# EAGLE design Adafruit OLED 128x32 Mono (EAGLE 9.6.2)
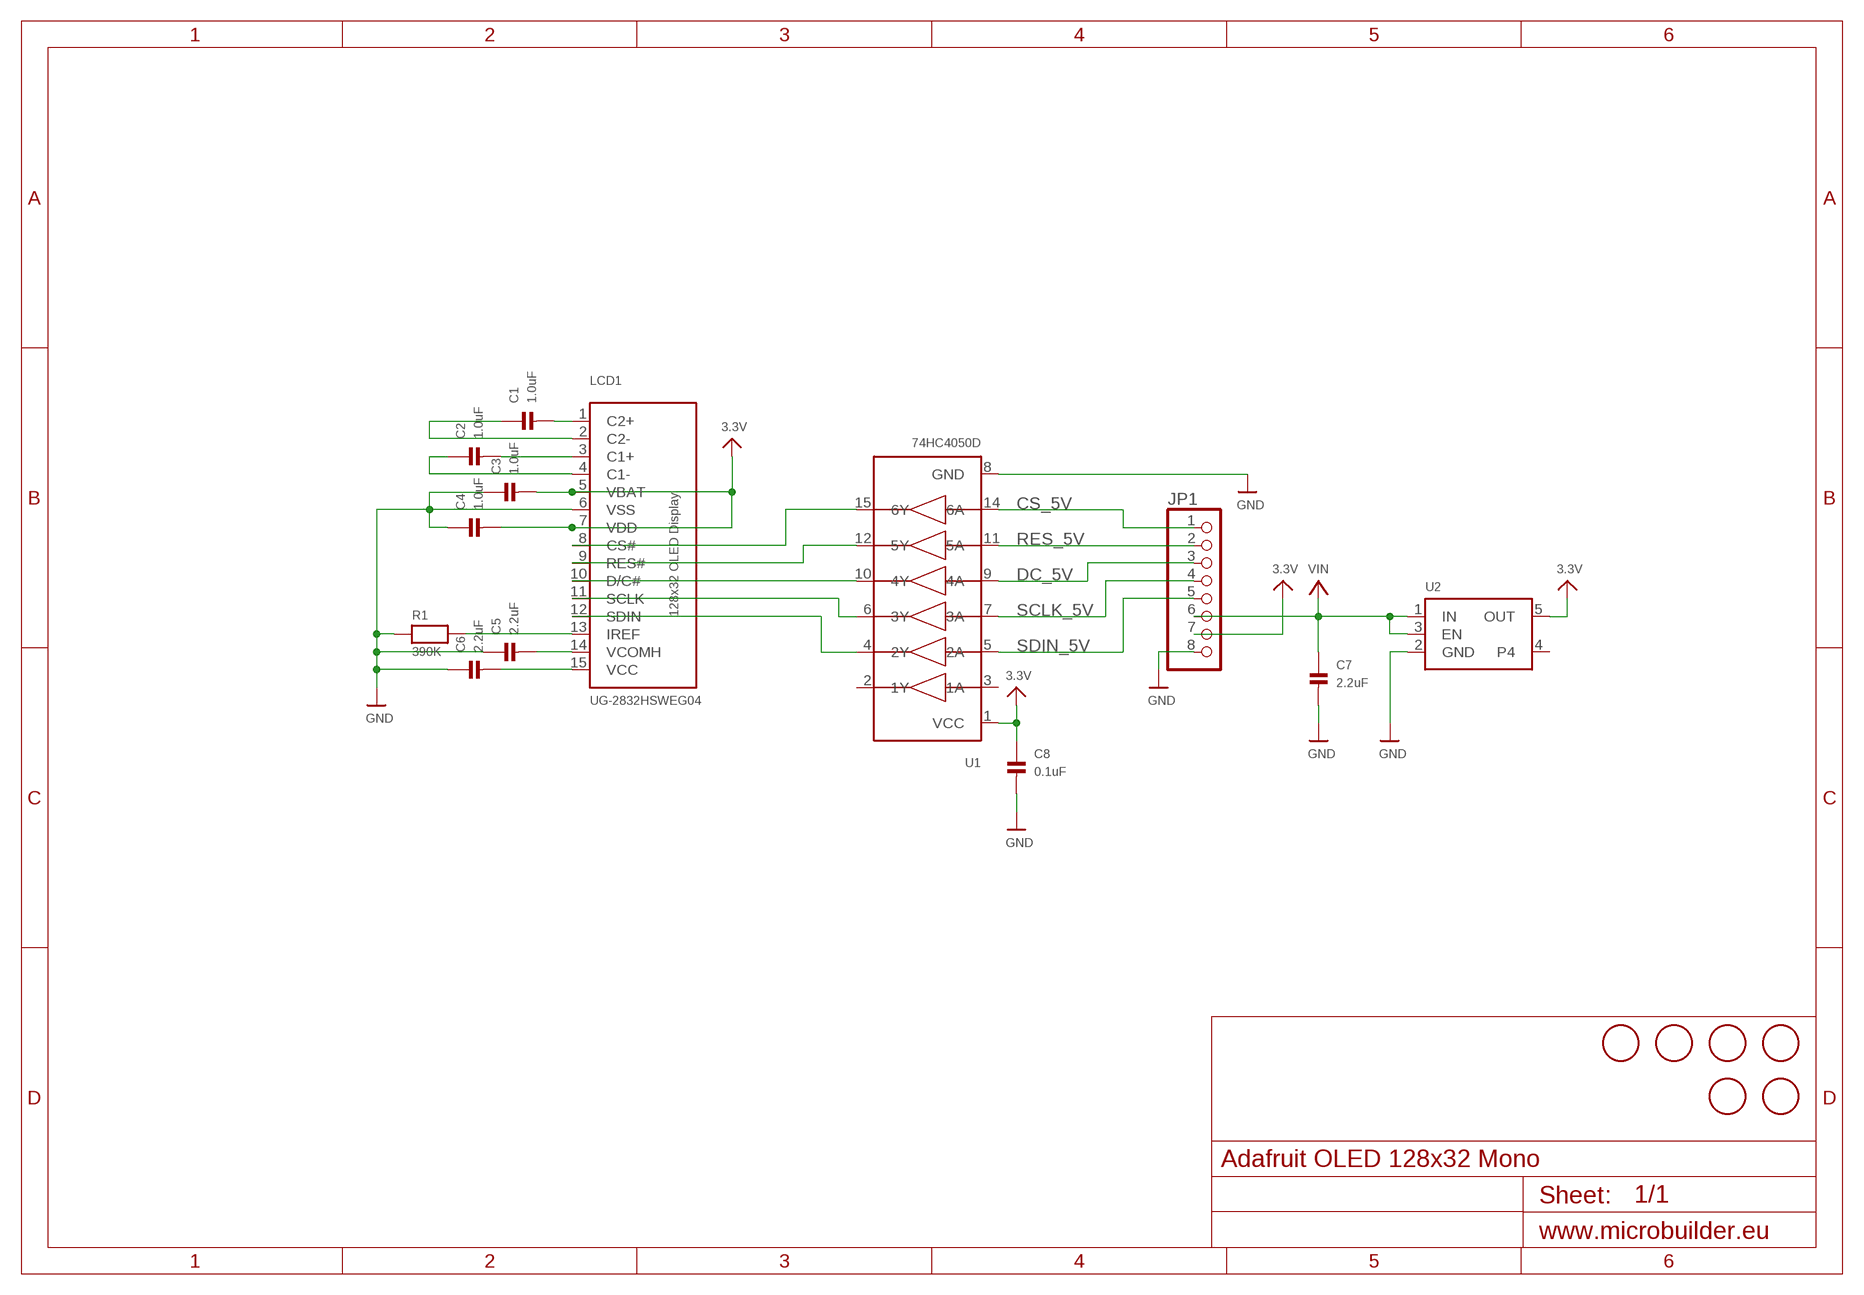
[diagram p0: schematic, sheet 1]

## Parts
C1  1.0uF  CAP_CERAMIC0805  [0805]
C2  1.0uF  CAP_CERAMIC0805  [0805]
C3  1.0uF  CAP_CERAMIC0805  [0805]
C4  1.0uF  CAP_CERAMIC0805  [0805]
C5  2.2uF  CAP_CERAMIC0805  [0805]
C6  2.2uF  CAP_CERAMIC0805  [0805]
C7  2.2uF  CAP_CERAMIC0805  [0805]
C8  0.1uF  CAP_CERAMIC0805  [0805]
JP1  HEADER-1X876MIL  [1X08_ROUND_76]
LCD1  UG-2832HSWEG04  OLED_UG-2832HSWEG04WRAPAROUND  [UG-2832HSWEG04_WRAPAROUND]
R1  390K  RESISTOR0805  [0805]
U1  74HC4050D  [SOIC16]
U2  VREG_SOT23-5  [SOT23-5]
U$2  MOUNTINGHOLE2.0  [MOUNTINGHOLE_2.0_PLATED]
U$3  MOUNTINGHOLE2.0  [MOUNTINGHOLE_2.0_PLATED]
U$4  MOUNTINGHOLE2.0  [MOUNTINGHOLE_2.0_PLATED]
U$5  MOUNTINGHOLE2.0  [MOUNTINGHOLE_2.0_PLATED]
U$6  FIDUCIAL  [FIDUCIAL_1MM]
U$7  FIDUCIAL  [FIDUCIAL_1MM]

## Nets
3.3V: C3.2 C4.2 C8.1 JP1.7 LCD1.5(VBAT) LCD1.7(VDD) U1.1(VCC) U2.5(OUT)
CS_5V: JP1.1 U1.14(6A)
DC_5V: JP1.3 U1.9(4A)
GND: C3.1 C4.1 C5.1 C6.1 C7.2 C8.2 JP1.8 LCD1.6(VSS) R1.1 U1.8(GND) U2.2(GND)
N$1: C1.1 LCD1.2(C2-)
N$2: C1.2 LCD1.1(C2+)
N$3: C2.1 LCD1.4(C1-)
N$4: C2.2 LCD1.3(C1+)
N$5: LCD1.8(CS#) U1.15(6Y)
N$8: LCD1.13(IREF) R1.2
N$9: C5.2 LCD1.14(VCOMH)
N$11: LCD1.9(RES#) U1.12(5Y)
N$12: LCD1.10(D/C#) U1.10(4Y)
N$13: LCD1.11(SCLK) U1.6(3Y)
N$14: LCD1.12(SDIN) U1.4(2Y)
N$15: C6.2 LCD1.15(VCC)
RES_5V: JP1.2 U1.11(5A)
SCLK_5V: JP1.4 U1.7(3A)
SDIN_5V: JP1.5 U1.5(2A)
VIN: C7.1 JP1.6 U2.1(IN) U2.3(EN)
Unconnected: U1.2(1Y) U1.3(1A) U2.4

## Library data of the parts
C1-C8 = microbuilder:CAP_CERAMIC: Ceramic Capacitors 0402 - 0402 Surface Mount Capacitors 16pF 50V 5% [Digikey: 445-4899-2-ND] 18pF 50V 5% [Digikey: 490-1281-2-ND] 22pF 50V 5% [Digikey: 490-1283-2-ND] 68pF 50V 5% [Digikey: 490-1289-2-ND] 0.1uF 10V 10% [Digikey: 490-1318-2-ND] 1.0uF 6.3V 10% [Digikey: 490-1320-2-ND] 0603 - 0603 Surface Mount Capacitors 16 pF 50V 5% [Digikey: 445-5051-2-ND] 22 pF 50V [Digikey: PCC220ACVTR-ND] 33 pF 50V 5% [Digikey: 490-1415-1-ND] 56pF 50V 5% [Digikey: 490-1421-1-ND] 220pF 50V 5% [Digikey: 445-1285-1-ND] 680 pF 50V 2200 pF 50V 5% C0G [Digikey: 445-1297-1-ND] 5600 pF 100V 5% X7R [Digikey: 478-3711-1-ND] 0.1 µF 25V 10% [Digikey: PCC2277TR-ND] 0.22 µF 16V 10% X7R [Digikey: 445-1318-1-ND] 1.0 µF 25V 10% [Digikey: 445-5146-2-ND] 0603 - RF Specific 3pF 250V +/-0.1pF RF [Digikey: 712-1347-1-ND] 18 pF 250V 5% [Digikey: 478-3505-1-ND or 712-1322-1-ND] 56 pF 250V 5% C0G RF [Digikey: 490-4867-1-ND] 68 pF 250V RF [Digikey: 490-4868-1-ND] 0805 - 0805 Surface Mount Capacitors 220 pF 250V 2% RF Ceramic Capacitor [Digikey: 712-1398-1-ND] 1000 pF 50V 2% NP0 Ceramic Capacitor [Digikey: 478-3760-1-ND] 0.1 µF 25V 10% Ceramic Capacitor [Digikey: PCC1828TR-ND] 1.0 µF 16V 10% Ceramic Capacitor[Digikey: 490-1691-2-ND] 10.0 µF 10V 10% Ceramic Capacitor[Digikey: 709-1228-1-ND] 10.0 uF 16V 10% Ceramic Capacitor [Digikey: 478-5165-2-ND] 47 uF 6.3V 20% Ceramic Capacitor [Digikey: 399-5506-1-ND] 1206 - 1206 Surface Mount Capacitors 47uF 10V 20% Ceramic Capacitor [Digikey: 399-5508-1-ND]
JP1 = microbuilder:HEADER-1X8: PIN HEADER
LCD1 = microbuilder:OLED_UG-2832HSWEG04: 128x32 SPI 0.91" Monochrome OLED Display
R1 = microbuilder:RESISTOR: Resistors 0402 - 0402 Surface Mount Package 22 Ohm 1% 1/16W [Digikey: 311-22.0LRTR-ND] 33 Ohm 5% 1/16W 1.0K 5% 1/16W 1.5K 5% 1/16W 2.0K 1% 1/16W 10.0K 1% 1/16W [Digikey: 311-10.0KLRTR-ND] 10.0K 5% 1/16W [Digikey: RMCF0402JT10K0TR-ND] 12.1K 1% 1/16W [Digikey: 311-22.0LRTR-ND] 100.0K 5% 1/16W 0603 - 0603 Surface Mount Package 0 Ohm 1/10 Watt 1% Resistor 15 Ohm 1/10 Watt 1% Resistor 33 Ohm 1/10 Watt 1% Resistor 49.9 Ohm 1/10 Watt 1% Resistor 100 Ohm 1/10 Watt 1% Resistor 150 Ohm 1/10 Watt 1% Resistor 240 Ohm 1/10 Watt 1% Resistor 390 Ohm 1/10 Watt 1% Resistor 560 Ohm 1/10 Watt 1% Resistor 680 Ohm 1/10 Watt 1% Resistor 750 Ohm 1/10 Watt 1% Resistor 1.0K Ohm 1/10 Watt 1% Resistor 1.5K Ohm 1/10 Watt 1% Resistor 2.0K Ohm 1/10 Watt 1% Resistor 2.2K Ohm 1/10 Watt 1% Resistor 3.3K Ohm 1/10 Watt 1% Resistor 4.7K Ohm 1/10 Watt 1% Resistor 10.0K Ohm 1/10 Watt 1% Resistor 12.0K Ohm 1/10 Watt 1% Resistor 12.1K Ohm 1/10 Watt 1% Resistor 20.0K Ohm 1/10 Watt 1% Resistor 33.0K Ohm 1/10 Watt 1% Resistor 100.0K Ohm 1/10 Watt 1% Resistor 0805 - 0805 Surface Mount Package 0 Ohm 1/8 Watt 1% Resistor 33 Ohm 1/8 Watt 1% Resistor 100 Ohm 1/8 Watt 1% Resistor 150 Ohm 1/8 Watt 1% Resistor 200 Ohm 1/8 Watt 1% Resistor 240 Ohm 1/8 Watt 1% Resistor 330 Ohm 1/8 Watt 1% Resistor 390 Ohm 1/8 Watt 1% Resistor 470 Ohm 1/8 Watt 1% Resistor 1.0K Ohm 1/8 Watt 1% Resistor 1.5K Ohm 1/8 Watt 1% Resistor 2.0K Ohm 1/8 Watt 1% Resistor 4.7K Ohm 1/8 Watt 1% Resistor 5.1K Ohm 1/8 Watt 1% Resistor 5.6K Ohm 1/8 Watt 1% Resistor 10.0K Ohm 1/8 Watt 1% Resistor 22.0K Ohm 1/8 Watt 1% Resistor 33.0K Ohm 1/8 Watt 1% Resistor 100K Ohm 1/8 Watt 1% Resistor 1206 - 1206 Surface Mount Package
U1 = microbuilder:74HC4050D: 6-channel level shifter 74HC4050D - 2V-6V Supply Digikey: 74HC4050D,653-ND Mouser: 771-74HC4050D-T
U2 = microbuilder:VREG_SOT23-5: SOT23-5 Fixed Voltage Regulators To better organise some of the SOT23-5 fixed voltage regulators in this library, this new part was created. Part Current Out V Out V In V Dropout Digikey Part No. ADP121 150mA 3.3V 3.4-5.5V 0.09V @ 150mA ADP121-AUJZ33R7CT-ND ADP121 150mA 3.0V 3.1-5.5V 0.09V @ 150mA ADP121-AUJZ30R7CT-ND ADP122 300mA 3.3V 3.4-5.5V 0.085V @ 300mA ADP122AUJZ-3.3-R7CT-ND ADP1712 300mA 3.3V 3.5-5.5V 0.17V @ 300mA ADP1712AUJZ-3.3-R7TR-ND AP7311 (Low Cost) 150mA 3.3V 3.5-6V 0.15V @ 150mA AP7311-33WG-7DICT-ND LD39015M18R 150mA 1.8V 1.9V-5.5V 0.08V @ 100mA 497-6977-1-ND MCP1824T-3302E/OT 300mA 3.3V 3.5V-6V 0.2V @ 300mA MCP1824T-3302E/OTCT-ND MIC5205-2.5YM5 TR 150mA 2.5V 2.7-16V 0.165V @ 150mA 576-1257-2-ND MIC5205-3.0YM5 TR 150mA 3.0V 3.2V-16V 0.165V @ 150mA 576-1258-2-ND MIC5205-3.3YM5 TR 150mA 3.3V 3.5V-16V 0.165V @ 150mA 576-1259-2-ND TPS780330220 150mA 3.3V+2.2V 3.6-5.5V 250mV Max 296-23332-1-ND TDA3663/N1,135 100mA 3.3V 3.5-45V 0.18V @ 50mA 568-5343-1-ND
U$2-U$5 = microbuilder:MOUNTINGHOLE: Mounting Hole
U$6 U$7 = adafruit:FIDUCIAL: For use by pick and place machines to calibrate the vision/machine, 1mm By microbuilder.eu

## Board
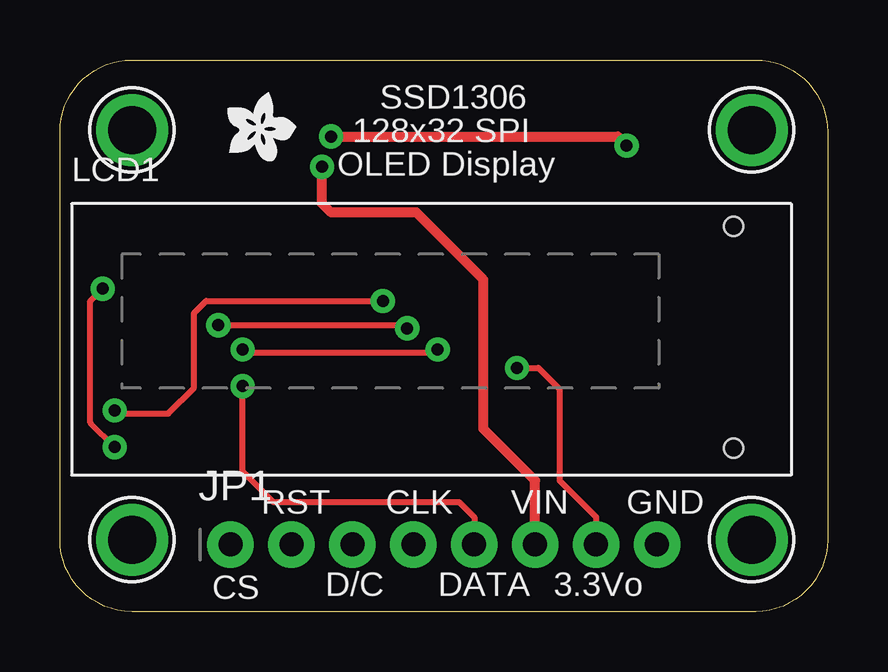
[diagram p1: board, top side]
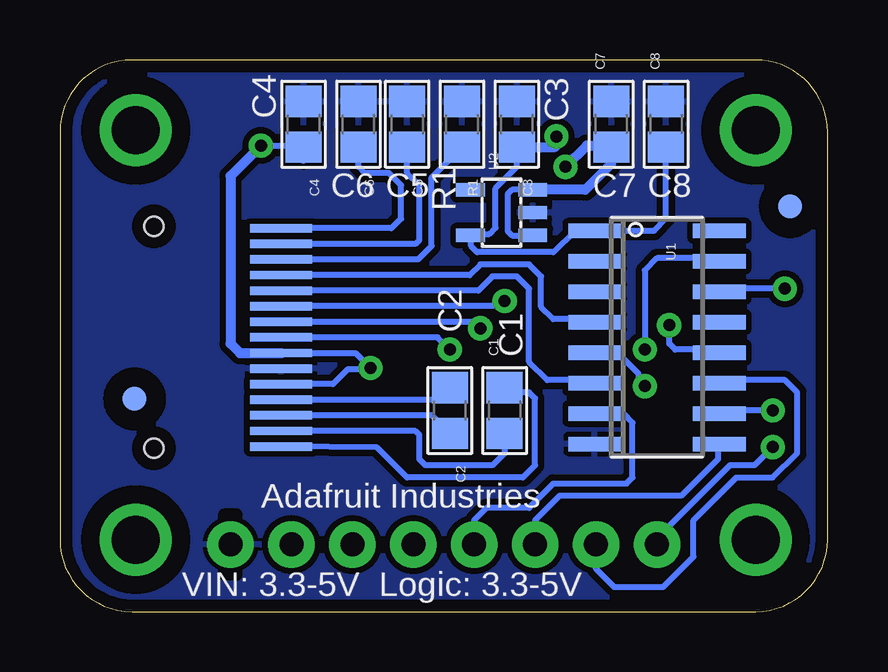
[diagram p2: board, bottom side, seen from below]

Size 32 x 23 mm. Coordinates in mm from the lower left corner, seen from the top.
Outline: 0,3 0,20 arc-90 3,23 29,23 arc-90 32,20 32,3 arc-90 29,0 3,0 arc-90 0,3
Copper layers (1*16): Top 0.035mm / dielectric 1.5mm / Bottom 0.035mm
Design rules "PCBCart-Standard": minimum track width 8mil, minimum drill 0.4mm, track to track 8mil, track to pad 8mil, pad to pad 8mil, via to via 8mil, smd to smd 8mil, copper to edge 20mil, drill to drill 8mil, minimum pad ring 8mil, minimum via ring 10mil, stop-mask expansion 3mil, vias tented up to drill 20mil, thermal gap 8mil
bRestrict: area 24.6,1.5 to 25.1,1.8; area 24.6,3.8 to 25.1,4.1

### Footprints (pad centres in the part's own frame; a part is rotated, then mirrored left to right if it is on the bottom)
0805 = smd 1.3 x 1.5: 1 -0.95,0; 2 0.95,0
1X08_ROUND_76 = drill 1 pad 1.93: 1 -8.89,0; 2 -6.35,0; 3 -3.81,0; 4 -1.27,0; 5 1.27,0; 6 3.81,0; 7 6.35,0; 8 8.89,0
UG-2832HSWEG04_WRAPAROUND = smd 2.6 x 0.35 bottom: 1 -7.7,-4.55; 2 -7.7,-3.9; 3 -7.7,-3.25; 4 -7.7,-2.6; 5 -7.7,-1.95; 6 -7.7,-1.3; 7 -7.7,-0.65; 8 -7.7,0; 9 -7.7,0.65; 10 -7.7,1.3; 11 -7.7,1.95; 12 -7.7,2.6; 13 -7.7,3.25; 14 -7.7,3.9; 15 -7.7,4.55 | hole 0.8: -2.4,4.625; -2.4,-4.625
SOIC16 = smd 0.6 x 2.2: 1 -4.445,-2.6; 2 -3.175,-2.6; 3 -1.905,-2.6; 4 -0.635,-2.6; 5 0.635,-2.6; 6 1.905,-2.6; 7 3.175,-2.6; 8 4.445,-2.6; 9 4.445,2.6; 10 3.175,2.6; 11 1.905,2.6; 12 0.635,2.6; 13 -0.635,2.6; 14 -1.905,2.6; 15 -3.175,2.6; 16 -4.445,2.6
SOT23-5 = smd 0.55 x 1.2: 1 -0.95,-1.3; 2 0,-1.3; 3 0.95,-1.3; 4 0.95,1.3; 5 -0.95,1.3
MOUNTINGHOLE_2.0_PLATED = drill 2 pad 3: P$1 0,0
FIDUCIAL_1MM = smd 1 x 1: 1 0,0

### Placement (x,y rotation side)
C1  13.46,8.38 90 bottom
C2  15.75,8.38 270 bottom
C3  12.95,20.32 270 bottom
C4  21.84,20.32 270 bottom
C5  17.53,20.32 270 bottom
C6  19.56,20.32 270 bottom
C7  9.02,20.32 90 bottom
C8  6.73,20.32 90 bottom
JP1  16,2.79 0 top
LCD1  30.48,11.43 0 top
R1  15.24,20.32 270 bottom
U1  7.11,11.43 270 bottom
U2  13.59,16.64 90 bottom
U$2  3,3 0 top
U$3  3,20.08 0 top
U$4  28.84,3 0 top
U$5  28.84,20.08 0 top
U$6  1.55,16.89 0 bottom
U$7  28.89,8.87 0 bottom
U$10  [ADAFRUIT200MIL]  8.38,20.32 270 top

### Tracks (layer width: path | path; a pad name or v marks a point on that pad's centre or on a via)
3.3V  (via drill 0.5)
  Top 0.254: JP1.7 22.35,3.94 20.83,5.46 20.83,9.27 19.94,10.16 v19.05,10.16
  Top 0.406: v11.3,19.81 23.24,19.81 v23.62,19.43
  Bottom 0.254: 21.84,18.8 C4.2 21.91,19.43 v23.62,19.43 | 22.34,10.78 LCD1.7 19.67,10.78 v19.05,10.16 19.11,10.1 20,10.1 20.62,9.48 LCD1.5 | 11.36,19.37 v11.3,19.81 | C3.2 12.95,18.54 13.84,17.65 13.84,16 14.1,15.75 14.83,15.75 U2.5 14.86,15.66 14.86,15.24 14.61,14.99 11.43,14.99 10.54,15.88 U1.1 7.24,15.88 6.73,16.38 C8.1
  Bottom 0.406: C3.2 11.36,19.37 | LCD1.7 24.5,10.78 24.89,11.18 24.89,18.16 v23.62,19.43
CS_5V  (via drill 0.5)
  Top 0.254: v2.29,6.86 1.27,7.87 1.27,12.95 v1.78,13.46
  Bottom 0.254: v2.29,6.86 3.05,6.1 4.06,6.1 6.73,3.43 6.73,3.17 JP1.1 | v1.78,13.46 4.38,13.46 U1.14
DC_5V
  Bottom 0.254: U1.9 4.57,6.92 4.57,6.35 6.1,4.83 11.18,4.83 12.19,3.81 JP1.3
GND
  pour Bottom (isolate 0.254): 0,23 32,23 32,0 0,0
N$1
  Bottom 0.254: LCD1.2 17.18,7.53 17.02,7.37 17.02,6.35 16.76,6.1 13.97,6.1 13.46,6.6 C1.1
N$2
  Bottom 0.254: LCD1.1 18.78,6.84 17.53,5.59 12.7,5.59 12.19,6.1 12.19,8.89 12.45,9.14 13.27,9.14 C1.2
N$3
  Bottom 0.254: LCD1.4 16.25,8.83 C2.1
N$4
  Bottom 0.254: LCD1.3 16.5,8.18 C2.2
N$5  (via drill 0.5)
  Top 0.254: v15.75,10.92 15.62,10.79 7.75,10.79 v7.62,10.92
  Bottom 0.254: LCD1.8 16.26,11.43 v15.75,10.92 | v7.62,10.92 7.62,14.22 7.11,14.73 4.64,14.73 U1.15
N$8
  Bottom 0.254: LCD1.13 17.07,14.68 16.51,15.24 16.51,18.1 R1.2
N$9
  Bottom 0.254: LCD1.14 17.18,15.33 17.02,15.49 17.02,17.78 17.53,18.29 C5.2
N$11  (via drill 0.5)
  Top 0.254: v6.6,11.94 14.35,11.94 v14.48,11.81
  Bottom 0.254: LCD1.9 14.75,12.08 v14.48,11.81 | v6.6,11.94 6.6,11.18 6.35,10.92 4.64,10.92 U1.12
N$12  (via drill 0.5)
  Top 0.254: v13.46,12.95 6.1,12.95 5.59,12.45 5.59,9.33 U1.10 2.41,8.26 v2.29,8.38
  Bottom 0.254: v2.29,8.38 4.38,8.38 U1.10 | LCD1.10 13.69,12.73 v13.46,12.95
N$13
  Bottom 0.254: U1.6 9.84,9.65 11.68,9.65 12.45,10.41 12.45,13.46 12.95,13.97 13.97,13.97 14.56,13.38 LCD1.11
N$14
  Bottom 0.254: LCD1.12 14.93,14.03 14.48,14.48 12.45,14.48 11.94,13.97 11.94,12.7 11.43,12.19 9.84,12.19 U1.4
N$15
  Bottom 0.254: C6.2 19.56,18.54 19.3,18.29 18.29,18.29 17.78,17.78 17.78,16.38 18.18,15.98 LCD1.15
RES_5V
  Bottom 0.254: U1.11 4.38,9.65 1.78,9.65 1.27,9.14 1.27,6.6 2.29,5.59 3.81,5.59 5.59,3.81 5.59,2.29 6.86,1.02 8.89,1.02 9.65,1.78 JP1.2
SCLK_5V
  Bottom 0.254: U1.7 8.51,8.26 8.13,7.87 8.13,5.59 8.38,5.33 11.43,5.33 12.45,4.32 14.22,4.32 14.73,3.81 JP1.4
SDIN_5V  (via drill 0.5)
  Top 0.254: v7.62,9.4 7.62,5.84 8.89,4.57 16.64,4.57 17.27,3.94 JP1.5
  Bottom 0.254: U1.5 9.59,10.67 8.64,10.67 7.87,9.91 7.87,9.65 v7.62,9.4
VIN  (via drill 0.5)
  Top 0.406: JP1.6 19.81,5.46 17.65,7.62 17.65,13.84 14.86,16.64 11.3,16.64 10.92,17.02 v10.92,18.54
  Bottom 0.254: 9.02,18.67 C7.1 9.08,19.43 | U2.3 13.15,17.59 13.34,17.4 13.34,15.88 13.15,15.69 U2.1
  Bottom 0.406: U2.3 10.1,17.59 9.02,18.67 | v10.92,18.54 10.03,19.43 9.08,19.43

### Text on the board
tPlace: SSD1306 | 128x32 SPI | OLED Display | RST | CLK | VIN | GND | CS | D/C | DATA | 3.3Vo
bPlace: C4 | C3 | R1 | C8 | C7 | C5 | C6 | C2 | C1 | Adafruit Industries | VIN: 3.3-5V Logic: 3.3-5V